# EAGLE design MurataMicroSD (EAGLE 7.5.0)
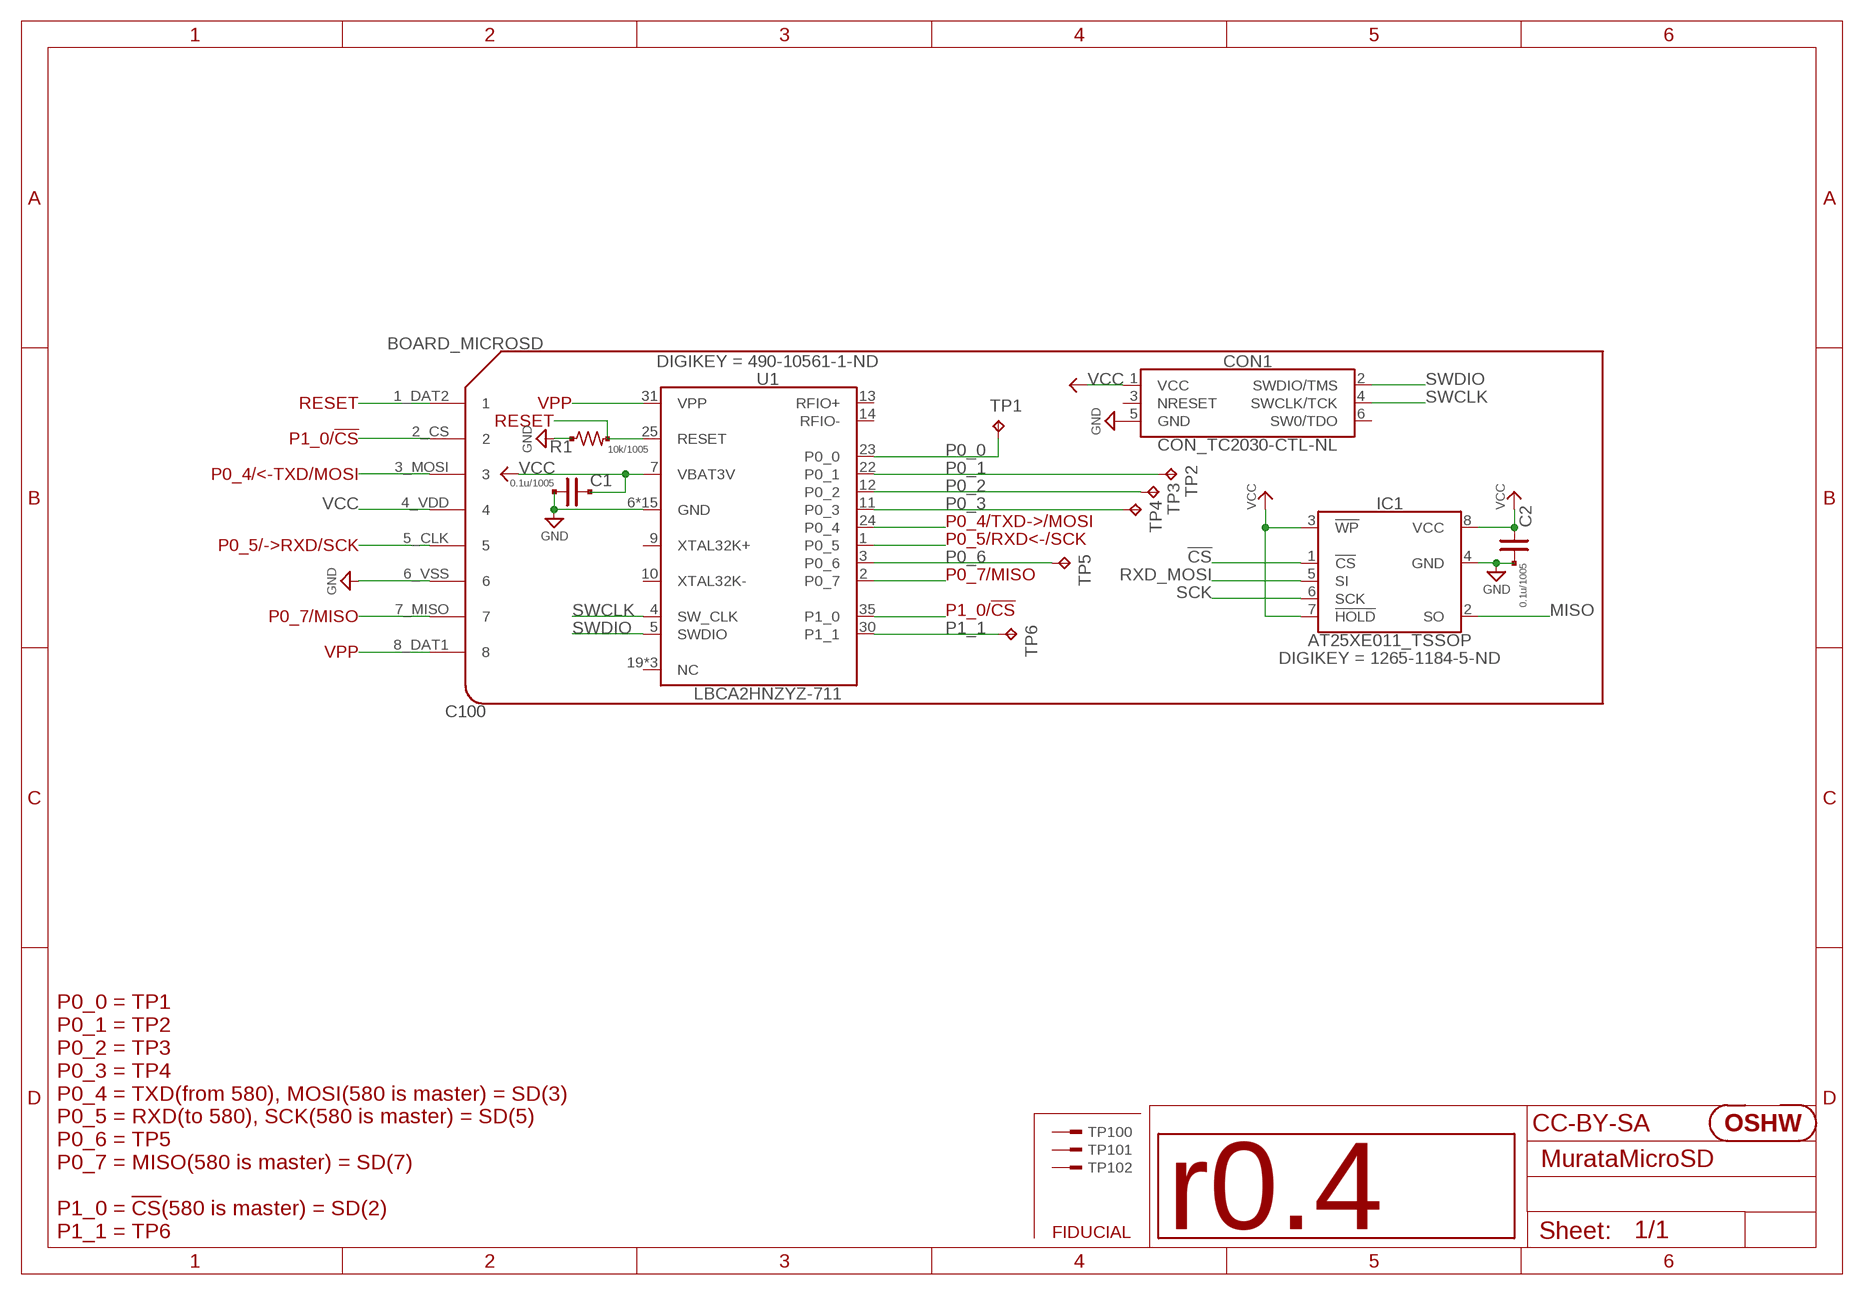
[diagram p0: schematic, sheet 1]

## Parts
C1  0.1u/1005  C_SMD_0.1U_1005  [C0402]
C2  0.1u/1005  C_SMD_0.1U_1005  [C0402]
C100  BOARD_MICROSD  [BOARD_MICROSD]
CON1  CON_TC2030-CTL-NL  [CON_TC2030-IDC-NL]
IC1  AT25XE011_TSSOP  IC_MEMORY_8P_AT25XE011_TSSOP  [IC_08_0.65_160MIL]
ICON1  r0.4  ICON_REVISION_1.2  [ICON_REVISION1.2]
R1  10k/1005  R_US_10K_1005  [C0402]
TP1  TPTP08R  [TP08R]
TP2  TPTP08R  [TP08R]
TP3  TPTP08R  [TP08R]
TP4  TPTP08R  [TP08R]
TP5  TPTP08R  [TP08R]
TP6  TPTP08R  [TP08R]
TP100  TESTPAD_F  [FIDUCIAL]
TP101  TESTPAD_F  [FIDUCIAL]
TP102  TESTPAD_F  [FIDUCIAL]
U1  LBCA2HNZYZ-711  [IC_MURATA_LBCA2HNZYZ-711]
U$1  ICON_OSHW  [ICON_OSHW]

## Nets
!CS!: C100.2_CS IC1.1(!CS) U1.35(P1_0)
GND: C1.2 C2.2 C100.6_VSS CON1.5(GND) IC1.4(GND) R1.1 U1.6(GND) U1.8(GND) U1.15(GND) U1.16(GND) U1.17(GND) U1.18(GND) U1.20(GND) U1.21(GND) U1.26(GND) U1.27(GND) U1.28(GND) U1.29(GND) U1.32(GND) U1.33(GND) U1.34(GND)
MISO: C100.7_MISO IC1.2(SO) U1.2(P0_7)
N$1: C100.1_DAT2 R1.2 U1.25(RESET)
P0_0: TP1.TP U1.23(P0_0)
P0_1: TP2.TP U1.22(P0_1)
P0_2: TP3.TP U1.12(P0_2)
P0_3: TP4.TP U1.11(P0_3)
P0_6: TP5.TP U1.3(P0_6)
P1_1: TP6.TP U1.30(P1_1)
RXD_MOSI: C100.3_MOSI IC1.5(SI) U1.24(P0_4)
SCK: C100.5_CLK IC1.6(SCK) U1.1(P0_5)
SWCLK: CON1.4(SWCLK/TCK) U1.4(SW_CLK)
SWDIO: CON1.2(SWDIO/TMS) U1.5(SWDIO)
VCC: C1.1 C2.1 C100.4_VDD CON1.1(VCC) IC1.3(!WP) IC1.7(!HOLD) IC1.8(VCC) U1.7(VBAT3V)
VPP: C100.8_DAT1 U1.31(VPP)
Unconnected: CON1.3(NRESET) CON1.6(SW0/TDO) TP100.TP TP101.TP TP102.TP U1.9(XTAL32K+) U1.10(XTAL32K-) U1.13(RFIO+) U1.14(RFIO-) U1.19(NC) U1.36(NC) U1.37(NC)

## Notes on the sheet
- RESET | VPP
- RESET
- P1_0/!CS!
- P0_4/<-TXD/MOSI
- P0_4/TXD->/MOSI
- P0_5/->RXD/SCK | P0_5/RXD<-/SCK
- P0_7/MISO
- P0_7/MISO | P1_0/!CS!
- VPP
- CC-BY-SA
- P0_0 = TP1
  P0_1 = TP2
  P0_2 = TP3
  P0_3 = TP4
  P0_4 = TXD(from 580), MOSI(580 is master) = SD(3)
  P0_5 = RXD(to 580), SCK(580 is master) = SD(5)
  P0_6 = TP5
  P0_7 = MISO(580 is master) = SD(7)
  
  P1_0 = !CS!(580 is master) = SD(2)
  P1_1 = TP6
- FIDUCIAL

## Library data of the parts
C1 C2 = mylib:C_SMD_*: SMD CAPACITOR; DIGIKEY: 490-3261-1-ND
C100 = mylib:BOARD_MICROSD
CON1 = mylib:CON_TC2030
IC1 = mylib:IC_MEMORY_8P_*; DIGIKEY: 1265-1184-5-ND; MOUSER: !non-stock! 988-AT25XE011-SSHN-B
ICON1 = mylib:ICON_REVISION
R1 = mylib:R_US_*: SMD resistor Packages : _1608 : 1.6 x 0.8 mm _2125 : 2.0 x 1.25 mm _3216 : 3.2 x 1.6 mm; DIGIKEY: P10.0KLCT-ND
TP1-TP6 = testpad_local:TP: Test pad
TP100-TP102 = mylib:TESTPAD: test points; NOT_COMPONENT: YES
U1 = mylib:LBCA2HNZYZ-711; DIGIKEY: 490-10561-1-ND; MOUSER: 81-LBCA2HNZYZ-711
U$1 = mylib:ICON_OSHW: Silk icon of OSHW; NOT_COMPONENT: YES

## Board
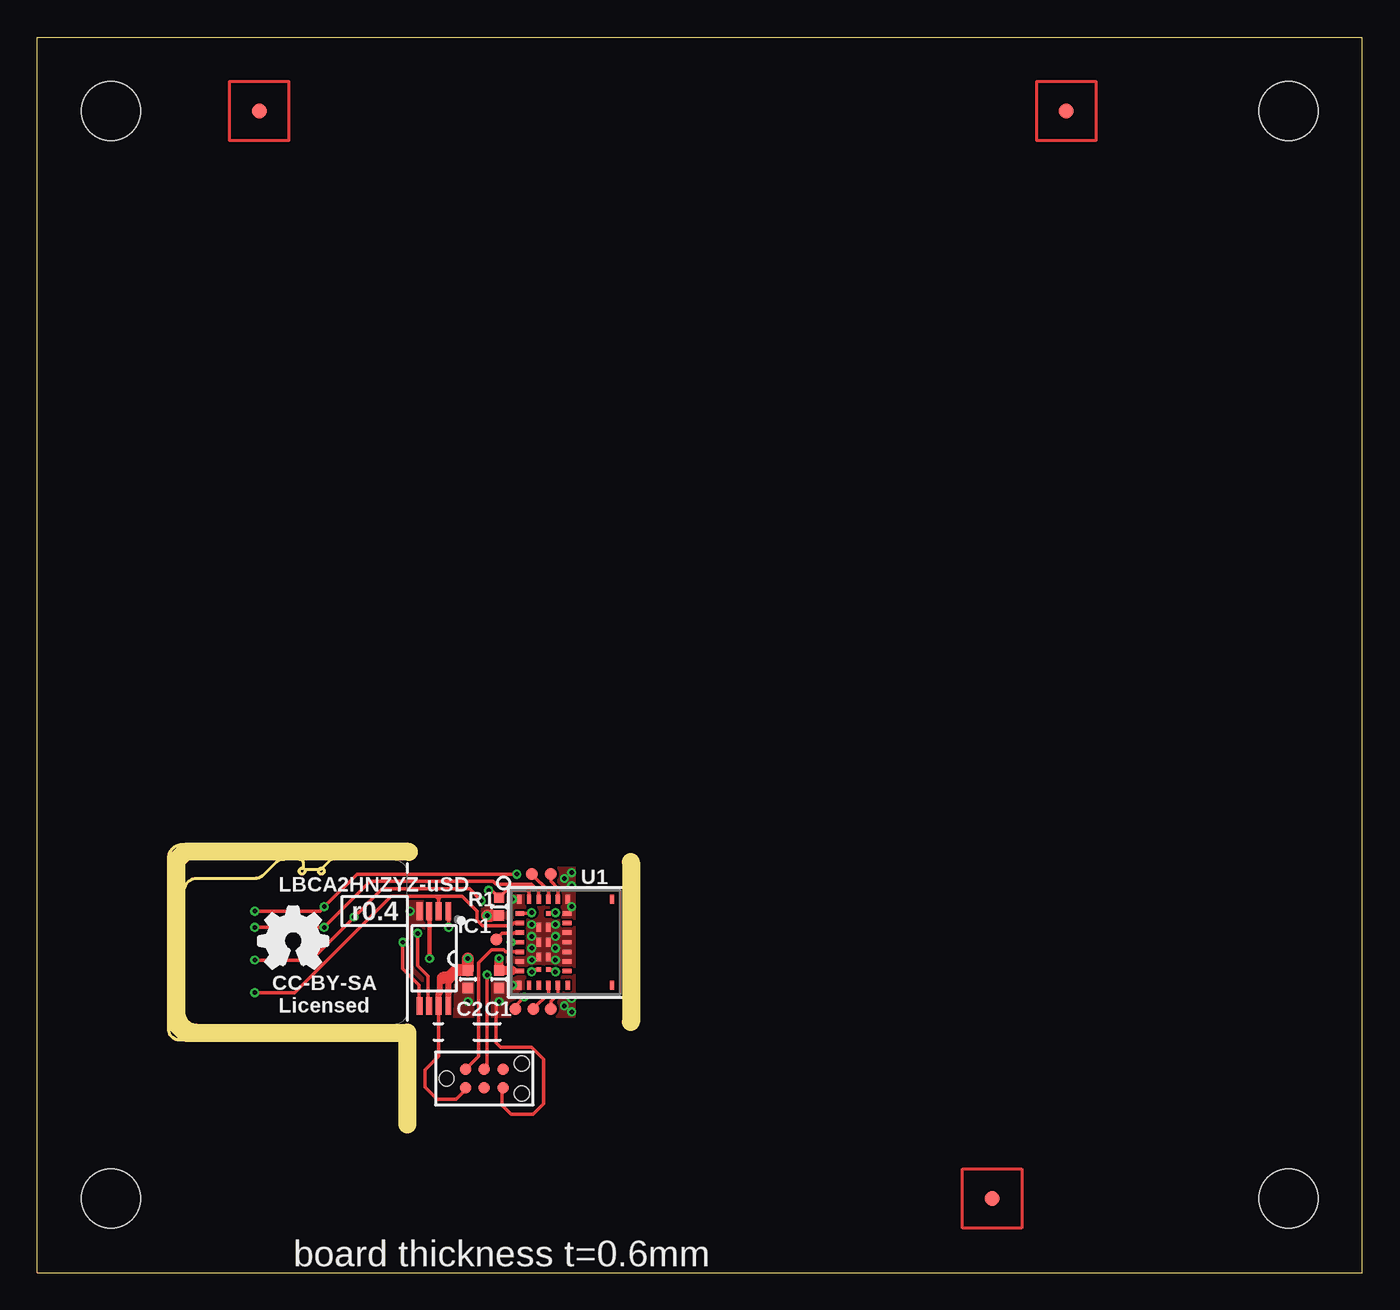
[diagram p1: board, top side]
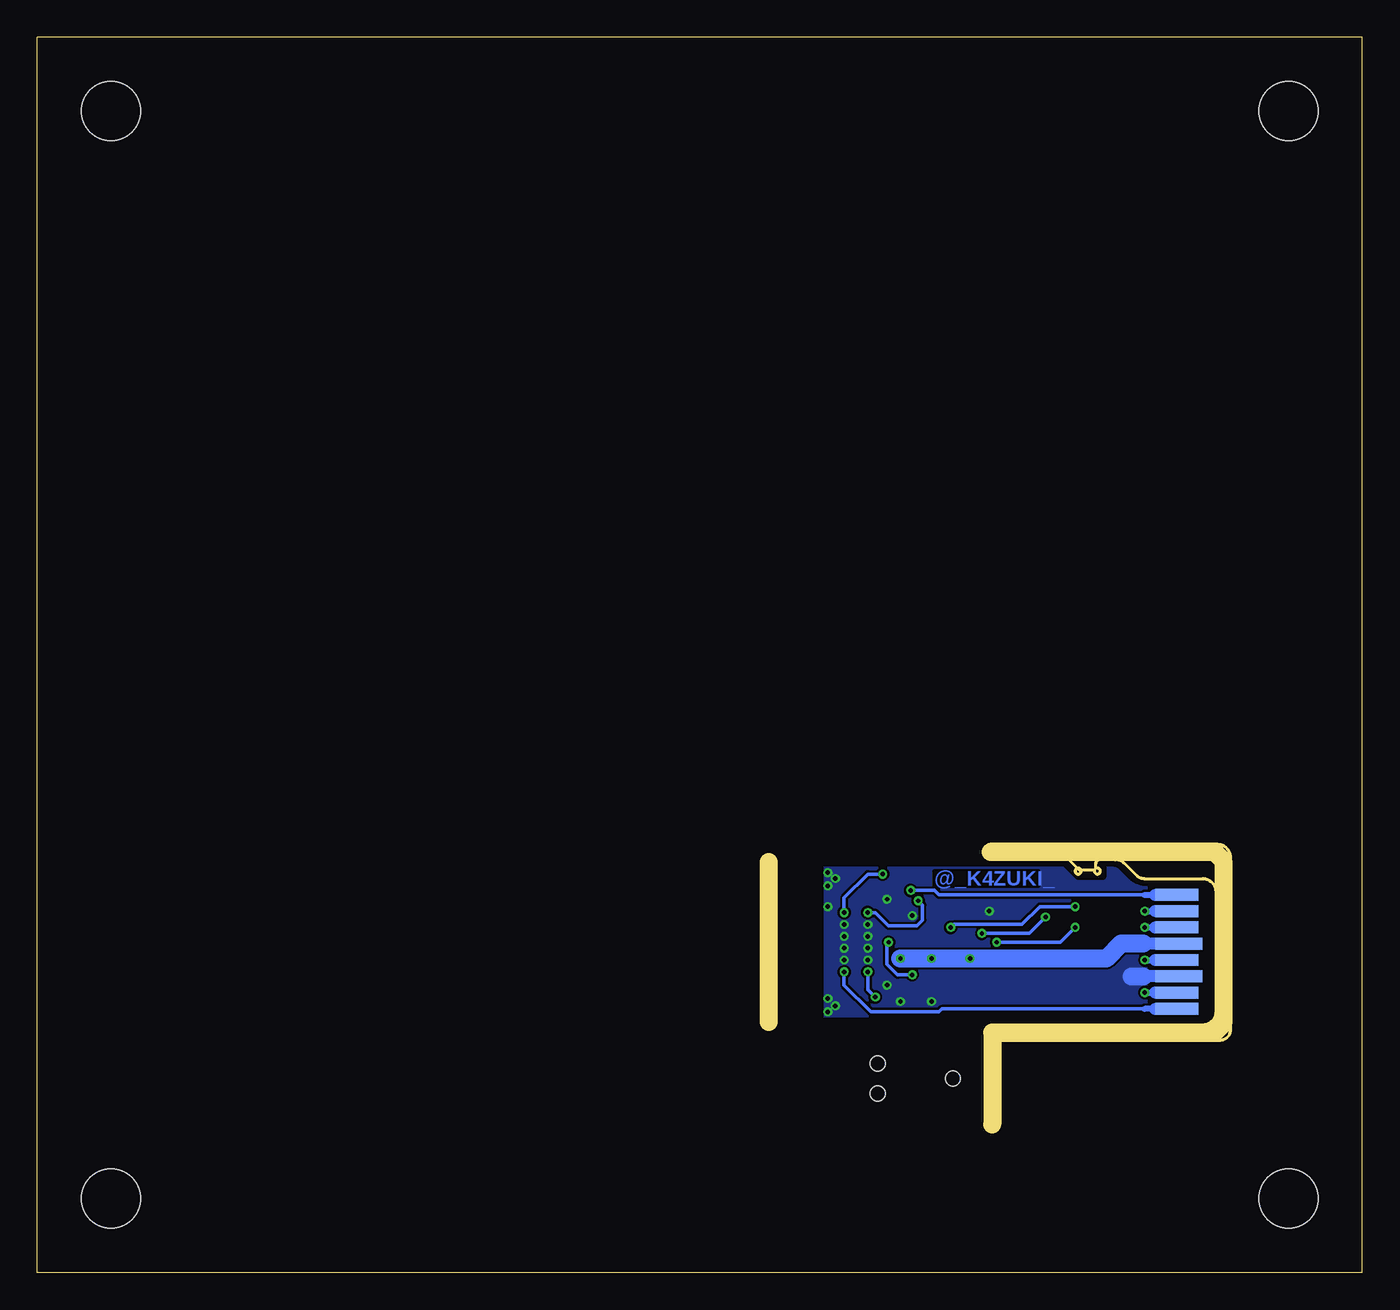
[diagram p2: board, bottom side, seen from below]

Size 89.5 x 83.4 mm. Coordinates in mm from the lower left corner, seen from the top.
Outline: 0,0 89.5,0 89.5,83.4 0,83.4 0,0
Copper layers (1*16): Top 0.0356mm / dielectric 1.5011mm / Bottom 0.0356mm
Design rules "SilverCircuits.2 *": minimum track width 0.15mm, minimum drill 0.3mm, track to track 0.15mm, track to pad 0.15mm, pad to pad 0.15mm, via to via 0.15mm, smd to smd 0mil, copper to edge 0.4mm, drill to drill 0.15mm, minimum pad ring 10mil, minimum via ring 0.15mm, stop-mask expansion 4mil, vias tented up to drill 100mil, thermal gap 10mil
Holes 4 mm at 5,5 84.5,5 5,78.4 84.5,78.4
tRestrict: area 36.4,16.8 to 39.5,27.8; 8 lines
bRestrict: area 36.4,16.8 to 39.5,27.8; area 10,16.8 to 14.5,27.8; 2 lines
Milling: area 25,27.9 to 25.6,28.9; 7 lines

### Footprints (pad centres in the part's own frame; a part is rotated, then mirrored left to right if it is on the bottom)
C0402 = smd 0.7 x 0.7: 1 -0.6,0; 2 0.6,0
BOARD_MICROSD = smd 2.9 x 0.8: 1_DAT2 2.55,2.3; 2_CS 2.55,3.4; 3_MOSI 2.55,4.5; 5_CLK 2.55,6.7; 7_MISO 2.55,8.9; 8_DAT1 2.55,10 | smd 3.2 x 0.8: 4_VDD 2.4,5.6; 6_VSS 2.4,7.8
CON_TC2030-IDC-NL = smd 0.787 x 0.787: 1 -1.27,-0.635; 2 -1.27,0.635; 3 0,-0.635; 4 0,0.635; 5 1.27,-0.635; 6 1.27,0.635 | hole 0.991: -2.54,0; 2.54,1.016; 2.54,-1.016
IC_08_0.65_160MIL = smd 0.4 x 1.2: 1 -0.975,-3.2; 2 -0.325,-3.2; 3 0.325,-3.2; 4 0.975,-3.2; 5 0.975,3.2; 6 0.325,3.2; 7 -0.325,3.2; 8 -0.975,3.2
TP08R = smd 0.8 x 0.8: TP 0,0
FIDUCIAL = smd 1 x 1: TP 0,0
IC_MURATA_LBCA2HNZYZ-711 = smd 0.3 x 0.6: 1 1.55,0.6; 2 2.2,0.6; 3 2.85,0.6; 4 3.5,0.6; 5 4.15,0.6; 6 4.8,0.6; 7 5.45,0.6; 14 5.45,3.8; 15 4.8,3.8; 16 4.15,3.8; 17 3.5,3.8; 18 2.85,3.8; 19 2.2,3.8; 20 1.55,3.8 | smd 0.6 x 0.3: 8 6.4,0.575; 9 6.4,1.225; 10 6.4,1.875; 11 6.4,2.525; 12 6.4,3.175; 13 6.4,3.825; 21 0.6,3.825; 22 0.6,3.175; 23 0.6,2.525; 24 0.6,1.875; 25 0.6,1.225; 26 0.6,0.575; 27 2.5,1.875; 28 3.5,1.875; 29 4.5,1.875; 32 4.5,2.525; 33 3.5,2.525; 34 2.5,2.525; 36 6.4,6.825; 37 0.6,6.825 | smd 0.3 x 0.3: 30 5.35,1.875; 31 5.35,2.525; 35 1.55,2.525

### Placement (x,y rotation side)
C1  31.2,19.8 270 top
C2  29.1,19.8 270 top
C100  10,27.8 180 bottom
CON1  30.2,13.1 0 top
IC1  26.8,21.2 180 top
ICON1  22.9,24.4 0 top
R1  31.2,24.7 90 top
TP1  33.4,26.9 0 top
TP2  34.7,26.9 0 top
TP3  34.7,17.8 0 top
TP4  33.5,17.8 0 top
TP5  31,22.5 0 top
TP6  32.3,17.8 0 top
TP100  15,78.4 0 top
TP101  64.5,5 0 top
TP102  69.5,78.4 0 top
U1  32,25.8 270 top
U$1  17.3,22.4 0 top

### Tracks (layer width: path | path; a pad name or v marks a point on that pad's centre or on a via)
!CS!  (via drill 0.3)
  Top 0.25: v32.4,26.9 21.6,26.9 v19.4,24.7 19.1,24.4 v14.7,24.4 | IC1.1 27.77,24.32 27.8,24.3 v27.8,23.3 | U1.35 34.95,24.25 v35,24.3
  Bottom 0.25: v19.4,24.7 21.8,24.7 23,23.5 27.6,23.5 v27.8,23.3 | v35,24.3 35,25.3 33.4,26.9 v32.4,26.9
  Bottom 0.4: v14.7,24.4 14,24.4
  Bottom 0.8: C100.2_CS 14,24.4
GND  (via drill 0.3, 0.3 pad 0.6)
  Top 0.25: CON1.5 31.4,12.4 31.4,11.3 32,10.7 33.5,10.7 34.2,11.4 34.2,14.4 33.4,15.2 31.3,15.2 31,15.5 31,18.3 v31.2,18.3
  Top 0.6: 30.7,24.1 R1.1 | v32.1,19.4 32.4,19.4
  Top 0.8: v30.4,24.1 30.7,24.1
  Bottom 0.8: C100.6_VSS 14.8,20
  Bottom 1.2: 15.6,20 14.8,20
  other vias: 33.4,21.1 33.4,23.5 35,23.5 35,22.7 35,21.9 35,21.1 32.1,25.2 36.1,27 35.6,26.6 36.1,26.1 36.1,24.7 36.1,18.5 35.6,18 36.1,17.6 33.4,22.7 33.4,21.9 25.2,24.4 29.1,18.3
  pour Bottom: 10,27.8 39.5,27.8 39.5,16.8 10,16.8
  pour Top (no thermals): 25.1,27.8 39.5,27.8 39.5,16.8 25.1,16.8
MISO  (via drill 0.3)
  Top 0.25: U1.2 32.2,23.6 32,23.4 30.1,23.4 29.7,23.8 29.7,24.4 28.7,25.4 27.3,25.4 | 27.3,25.4 27.1,25.4 | 27.1,25.4 26.9,25.4 | 26.9,25.4 23.9,25.4 17.4,18.9 v14.7,18.9 | IC1.2 27.12,24.77 27.1,24.8 27.1,25.2 | 27.1,25.2 27.1,25.4 | 26.9,25.4 27.1,25.2 | 27.1,25.2 27.3,25.4
  Bottom 0.4: v14.7,18.9 14,18.9
  Bottom 0.8: C100.7_MISO 14,18.9
N$1  (via drill 0.3)
  Top 0.25: U1.25 33.23,25.68 33.1,25.8 31.7,25.8 R1.2 30.7,25.8 v30.5,25.8
  Bottom 0.25: v30.5,25.8 28.9,25.8 28.6,25.5 14.7,25.5
  Bottom 0.4: 14.7,25.5 14,25.5
  Bottom 0.8: 14,25.5 C100.1_DAT2
P0_0
  Top 0.25: U1.23 34.52,25.77 TP1.TP
P0_1
  Top 0.25: U1.22 35.17,25.93 34.7,26.4 TP2.TP
P0_2
  Top 0.25: TP3.TP 34.7,18.3 35.17,18.77 U1.12
P0_3
  Top 0.25: U1.11 34.52,18.82 TP4.TP
P0_6
  Top 0.25: U1.3 32.25,22.95 32.2,22.9 31.4,22.9 TP5.TP
P1_1  (via drill 0.3)
  Top 0.25: U1.30 33.55,20.45 v33.4,20.3 | TP6.TP 32.3,18 v32.9,18.6
  Bottom 0.25: v33.4,20.3 33.4,19.1 v32.9,18.6
RXD_MOSI  (via drill 0.3)
  Top 0.25: U1.24 33.88,25.73 33.4,26.2 31,26.2 30.8,26.4 22.5,26.4 v19.4,23.3 v14.7,23.3 | IC1.5 25.82,18.07 25.8,18.1 25.8,19.4 24.7,20.5 v24.7,22.3
  Bottom 0.25: v19.4,23.3 20.4,22.3 v24.7,22.3
  Bottom 0.4: v14.7,23.3 14,23.3
  Bottom 0.8: C100.3_MOSI 14,23.3
SCK  (via drill 0.3, 0.3 pad 0.6)
  Top 0.25: U1.1 33.35,24.25 v33.4,24.3 | v14.7,21.1 18.5,21.1 v21.4,24 23.3,25.9 29.2,25.9 v30,25.1 | IC1.6 26.48,18.02 26.4,18.1 26.4,20 25.7,20.7 v25.7,22.9
  Bottom 0.25: v33.4,24.3 32.9,24.3 32,23.4 30.1,23.4 29.7,23.8 29.7,24.8 v30,25.1 | v25.7,22.9 22.5,22.9 v21.4,24
  Bottom 0.4: v14.7,21.1 14,21.1
  Bottom 0.8: C100.5_CLK 14,21.1
SWCLK  (via drill 0.3 pad 0.6)
  Top 0.25: U1.4 v32,22.3 | CON1.4 30.23,13.73 30.4,13.9 v30.4,20.1
  Bottom 0.25: v30.4,20.1 31.4,20.1 32.1,20.8 32.1,22.2 v32,22.3
SWDIO
  Top 0.25: U1.5 31.65,21.65 31.5,21.8 30.7,21.8 29.8,20.9 29.8,14.6 CON1.2
VCC  (via drill 0.3)
  Top 0.25: CON1.1 28.93,12.33 28.3,11.7 27,11.7 26.2,12.5 26.2,13.7 27.1,14.6 27.1,18 IC1.7
  Top 0.3: U1.7 32.15,20.35 32.1,20.4 | IC1.3 26.48,24.32 26.5,24.3 v26.5,21.2
  Top 0.4: IC1.7 27.12,18.82 27.2,18.9 27.2,19.9 27.4,19.9 | IC1.8 27.77,18.88 27.8,18.9 27.8,19.9
  Top 0.6: v31.2,21.2 C1.1 32.1,20.4
  Top 0.8: v29.1,21.2 C2.1 28.3,20.4 27.8,19.9 27.4,19.9
  Bottom 0.8: C100.4_VDD 14.8,22.2
  Bottom 1.2: 14.8,22.2 16.3,22.2 17.3,21.2 v26.5,21.2 v29.1,21.2 v31.2,21.2
VPP  (via drill 0.3)
  Top 0.25: U1.31 34.85,20.45 v35,20.3
  Bottom 0.25: v35,20.3 35,19.4 33.2,17.6 28.6,17.6 28.4,17.8 14.7,17.8
  Bottom 0.4: 14,17.8 14.7,17.8
  Bottom 0.8: C100.8_DAT1 14,17.8

### Text on the board
Bottom: @_K4ZUKI_
tPlace: LBCA2HNZYZ-uSD | CC-BY-SA / Licensed | board thickness t=0.6mm
Vscore: V-CUT | V-CUT | V-CUT | V-CUT | V-CUT | V-CUT | V-CUT | V-CUT | V-CUT | V-CUT